# EAGLE design avr_bat (EAGLE 5.12)
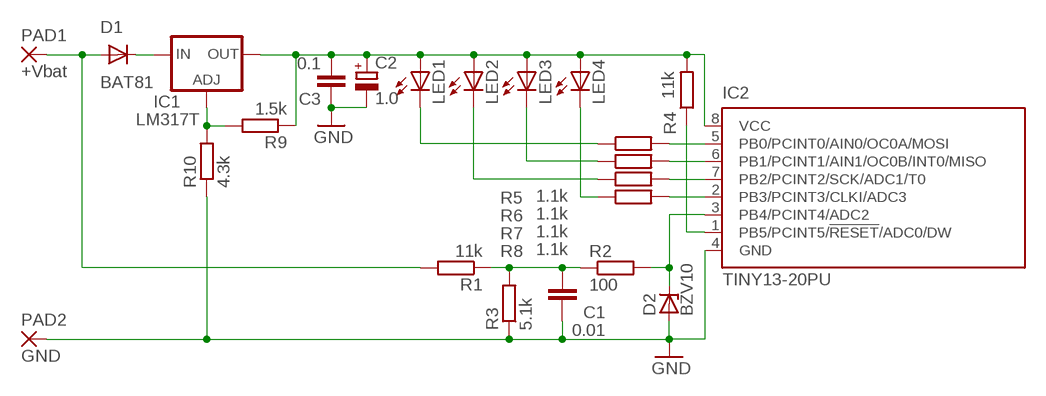
[diagram p0: schematic, sheet 1]

## Parts
C1  0.01  C-EU050-030X075  [C050-030X075]
C2  1.0  CPOL-EUE2-4  [E2-4]
C3  0.1  C-EU050-030X075  [C050-030X075]
D1  BAT81  [DO34-7]
D2  BZV10  [DO34Z7]
IC1  LM317T  LM317TL  [317TL]
IC2  TINY13-20PU  [DIL08]
LED1  LED5MM  [LED5MM]
LED2  LED5MM  [LED5MM]
LED3  LED5MM  [LED5MM]
LED4  LED5MM  [LED5MM]
PAD1  +Vbat  3,17/1,3  [3,17/1,3]
PAD2  GND  3,17/1,3  [3,17/1,3]
R1  11k  R-EU_0204/5  [0204/5]
R2  100  R-EU_0204/5  [0204/5]
R3  5.1k  R-EU_0204/5  [0204/5]
R4  11k  R-EU_0204/5  [0204/5]
R5  1.1k  R-EU_0204/5  [0204/5]
R6  1.1k  R-EU_0204/5  [0204/5]
R7  1.1k  R-EU_0204/5  [0204/5]
R8  1.1k  R-EU_0204/5  [0204/5]
R9  1.5k  R-EU_0204/5  [0204/5]
R10  4.3k  R-EU_0204/5  [0204/5]

## Nets
GND: C1.1 C2.- C3.1 D2.A IC2.4(GND) PAD2.1(P) R3.1 R10.1
N$1: IC2.1(PB5/PCINT5/!RESET!/ADC0/DW) R4.1
N$2: LED1.K(C) R5.1
N$3: IC2.5(PB0/PCINT0/AIN0/OC0A/MOSI) R5.2
N$4: LED2.K(C) R7.1
N$5: IC2.7(PB2/PCINT2/SCK/ADC1/T0) R7.2
N$6: IC2.6(PB1/PCINT1/AIN1/OC0B/INT0/MISO) R6.2
N$7: LED3.K(C) R6.1
N$8: LED4.K(C) R8.1
N$9: IC2.2(PB3/PCINT3/CLKI/ADC3) R8.2
N$10: D2.C IC2.3(PB4/PCINT4/ADC2) R2.2
N$11: C1.2 R1.1 R2.1 R3.2
N$12: IC1.1(ADJ) R9.2 R10.2
N$13: C2.+ C3.2 IC1.2(OUT) IC2.8(VCC) LED1.A LED2.A LED3.A LED4.A R4.2 R9.1
N$14: D1.C IC1.3(IN)
N$20: D1.A PAD1.1(P) R1.2

## Library data of the parts
C1 C3 = resistor:C-EU: CAPACITOR, European symbol
C2 = resistor:CPOL-EU: POLARIZED CAPACITOR, European symbol
D1 = diode:BAT81: DIODE barrier diode
D2 = diode:BZV10: Z DIODE
IC1 = v-reg:LM317TL: VOLTAGE REGULATOR
IC2 = atmel:TINY13: 8-bit AVR Microcontroller with 1K Bytes In-System Programmable Flash Source: http://www.atmel.com/dyn/resources/prod_documents/2535S.pdf; MPN: ATTINY13-20PU; OC_FARNELL: 9171550; OC_NEWARK: 96K6521
LED1-LED4 = led:LED: LED OSRAM: - CHIPLED LG R971, LG N971, LY N971, LG Q971, LY Q971, LO R971, LY R971 LH N974, LH R974 LS Q976, LO Q976, LY Q976 LO Q996 - Hyper CHIPLED LW Q18S LB Q993, LB Q99A, LB R99A - SideLED LS A670, LO A670, LY A670, LG A670, LP A670 LB A673, LV A673, LT A673, LW A673 LH A674 LY A675 LS A676, LA A676, LO A676, LY A676, LW A676 LS A679, LY A679, LG A679 - Hyper Micro SIDELED® LS Y876, LA Y876, LO Y876, LY Y876 LT Y87S - SmartLED LW L88C, LW L88S LB L89C, LB L89S, LG L890 LS L89K, LO L89K, LY L89K LS L896, LA L896, LO L896, LY L896 - TOPLED LS T670, LO T670, LY T670, LG T670, LP T670 LSG T670, LSP T670, LSY T670, LOP T670, LYG T670 LG T671, LOG T671, LSG T671 LB T673, LV T673, LT T673, LW T673 LH T674 LS T676, LA T676, LO T676, LY T676, LB T676, LH T676, LSB T676, LW T676 LB T67C, LV T67C, LT T67C, LS T67K, LO T67K, LY T67K, LW E67C LS E67B, LA E67B, LO E67B, LY E67B, LB E67C, LV E67C, LT E67C LW T67C LS T679, LY T679, LG T679 LS T770, LO T770, LY T770, LG T770, LP T770 LB T773, LV T773, LT T773, LW T773 LH T774 LS E675, LA E675, LY E675, LS T675 LS T776, LA T776, LO T776, LY T776, LB T776 LHGB T686 LT T68C, LB T68C - Hyper Mini TOPLED® LB M676 - Mini TOPLED Santana® LG M470 LS M47K, LO M47K, LY M47K Source: http://www.osram.convergy.de LUXEON: - LUMILED® LXK2-PW12-R00, LXK2-PW12-S00, LXK2-PW14-U00, LXK2-PW14-V00 LXK2-PM12-R00, LXK2-PM12-S00, LXK2-PM14-U00 LXK2-PE12-Q00, LXK2-PE12-R00, LXK2-PE12-S00, LXK2-PE14-T00, LXK2-PE14-U00 LXK2-PB12-K00, LXK2-PB12-L00, LXK2-PB12-M00, LXK2-PB14-N00, LXK2-PB14-P00, LXK2-PB14-Q00 LXK2-PR12-L00, LXK2-PR12-M00, LXK2-PR14-Q00, LXK2-PR14-R00 LXK2-PD12-Q00, LXK2-PD12-R00, LXK2-PD12-S00 LXK2-PH12-R00, LXK2-PH12-S00 LXK2-PL12-P00, LXK2-PL12-Q00, LXK2-PL12-R00 Source: www.luxeon.com KINGBRIGHT: KA-3528ASYC Source: www.kingbright.com
PAD1 PAD2 = wirepad:3,17/1,3: THROUGH-HOLE PAD
R1-R10 = resistor:R-EU_: RESISTOR, European symbol

## Board
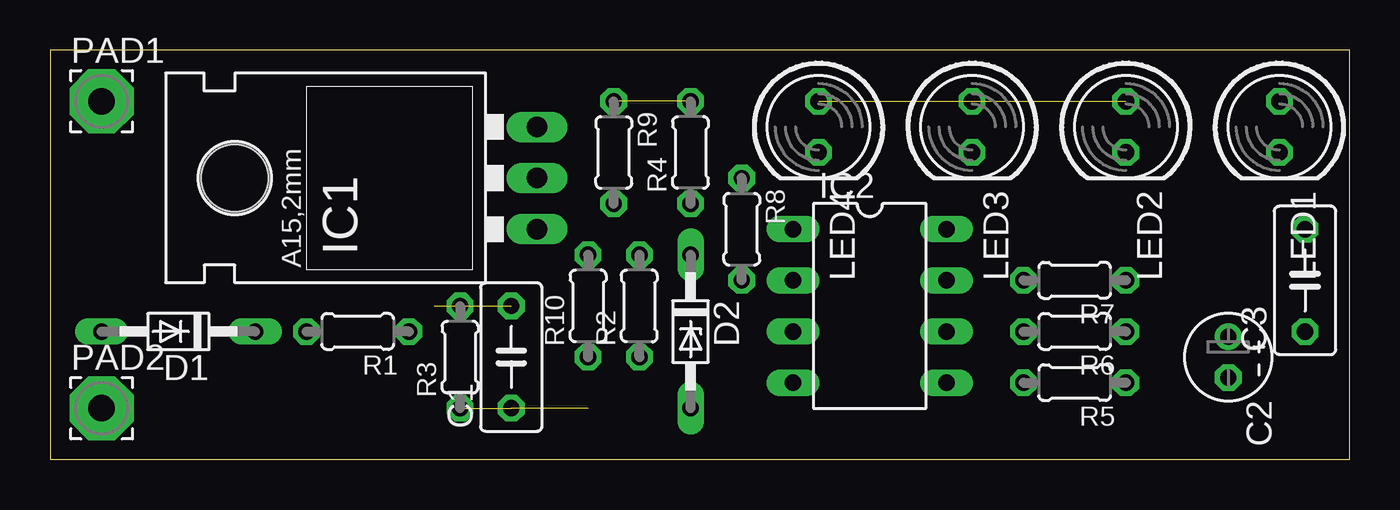
[diagram p1: board, top side]
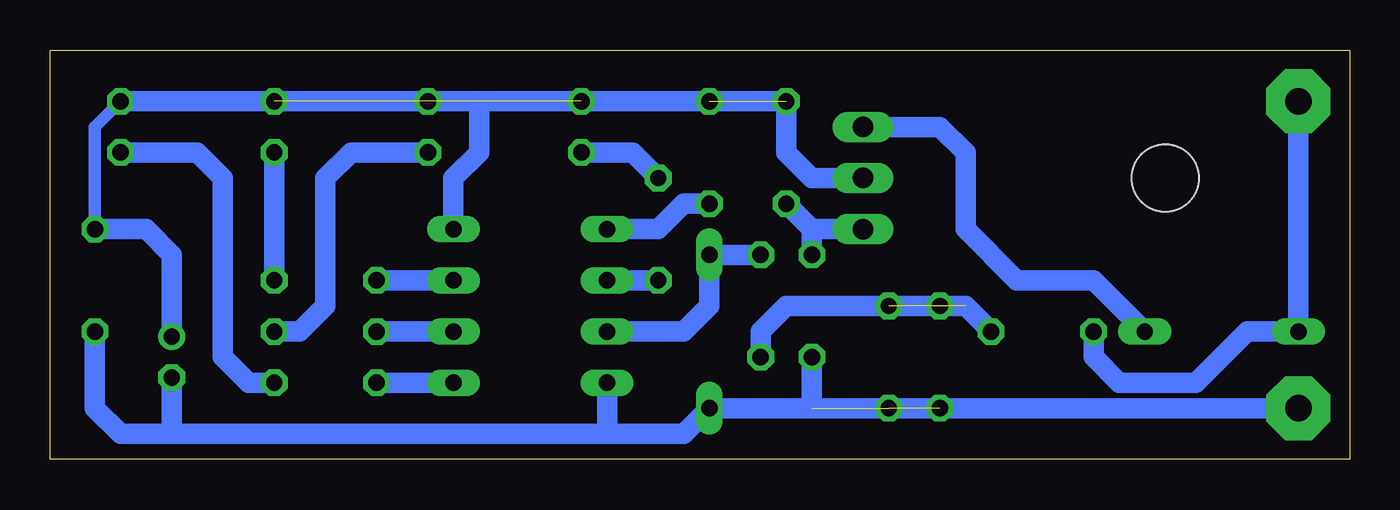
[diagram p2: board, bottom side, seen from below]

Size 64.44 x 20.31 mm. Coordinates in mm from the lower left corner, seen from the top.
Outline: 0,0 64.44,0 64.44,20.31 0,20.31 0,0
Copper layers (1*16): Top 0.035mm / dielectric 1.5mm / Bottom 0.035mm
Design rules "default": minimum track width 10mil, minimum drill 24mil, track to track 8mil, track to pad 8mil, pad to pad 8mil, via to via 8mil, smd to smd 8mil, copper to edge 40mil, drill to drill 8mil, minimum pad ring 10mil, minimum via ring 8mil, stop-mask expansion 4mil, vias tented up to drill 0mil, thermal gap 10mil

### Footprints (pad centres in the part's own frame; a part is rotated, then mirrored left to right if it is on the bottom)
C050-030X075 = drill 0.813 octagon: 1 -2.54,0; 2 2.54,0
E2-4 = drill 0.813 pad 1.27 round: + -1.016,0 | drill 0.813 pad 1.27 octagon: - 1.016,0
DO34-7 = drill 0.813 long: A 3.81,0; C -3.81,0
DO34Z7 = drill 0.813 long: A 3.81,0; C -3.81,0
317TL = drill 1.016 long: 1 -2.54,-3.81; 2 0,-3.81; 3 2.54,-3.81 | hole 3.302: 0,11.176
DIL08 = drill 0.813 long: 1 -3.81,-3.81; 2 -1.27,-3.81; 3 1.27,-3.81; 4 3.81,-3.81; 5 3.81,3.81; 6 1.27,3.81; 7 -1.27,3.81; 8 -3.81,3.81
LED5MM = drill 0.813 octagon: A -1.27,0; K 1.27,0
3,17/1,3 = drill 1.321 pad 3.175 octagon: 1 0,0
0204/5 = drill 0.813 octagon: 1 -2.54,0; 2 2.54,0

### Placement (x,y rotation side)
C1  22.86,5.08 90 top
C2  58.42,5.08 270 top
C3  62.23,8.89 90 top
D1  6.35,6.35 180 top
D2  31.75,6.35 270 top
IC1  20.32,13.97 90 top
IC2  40.64,7.62 270 top
LED1  60.96,16.51 270 top
LED2  53.34,16.51 270 top
LED3  45.72,16.51 270 top
LED4  38.1,16.51 270 top
PAD1  2.54,17.78 0 top
PAD2  2.54,2.54 0 top
R1  15.24,6.35 180 top
R2  29.21,7.62 90 top
R3  20.32,5.08 90 top
R4  31.75,15.24 90 top
R5  50.8,3.81 180 top
R6  50.8,6.35 180 top
R7  50.8,8.89 180 top
R8  34.29,11.43 270 top
R9  27.94,15.24 270 top
R10  26.67,7.62 90 top

### Tracks (layer width: path | path; a pad name or v marks a point on that pad's centre or on a via)
GND  (2 unrouted)
  Bottom 1.016: PAD2.1 26.67,2.54 | 26.67,2.54 D2.A 33.02,1.27 36.83,1.27 | 26.67,2.54 R10.1 | 36.83,1.27 58.42,1.27 | 58.42,1.27 C2.- | 36.83,1.27 IC2.4 | 58.42,1.27 60.96,1.27 62.23,2.54 C3.1
N$1
  Bottom 1.016: R4.1 33.02,12.7 34.29,11.43 IC2.1
N$2
  Bottom 1.016: R5.1 54.61,3.81 55.88,5.08 55.88,13.97 57.15,15.24 LED1.K
N$3
  Bottom 1.016: IC2.5 R5.2
N$4
  Bottom 1.016: R7.1 LED2.K
N$5
  Bottom 1.016: IC2.7 R7.2
N$6
  Bottom 1.016: IC2.6 R6.2
N$7
  Bottom 1.016: R6.1 52.07,6.35 50.8,7.62 50.8,13.97 49.53,15.24 LED3.K
N$8
  Bottom 1.016: R8.1 35.56,15.24 LED4.K
N$9
  Bottom 1.016: R8.2 IC2.2
N$10
  Bottom 1.016: IC2.3 33.02,6.35 31.75,7.62 D2.C R2.2
N$11  (2 unrouted)
  Bottom 1.016: R1.1 19.05,7.62 27.94,7.62 29.21,6.35 R2.1
N$12
  Bottom 1.016: IC1.1 26.67,11.43 | 26.67,11.43 R9.2 | R10.2 26.67,11.43
N$13  (4 unrouted)
  Bottom 0.61: LED1.A 62.23,16.51 C3.2
  Bottom 1.016: IC1.2 26.67,13.97 27.94,15.24 R9.1 43.18,17.78 | 43.18,17.78 LED1.A | IC2.8 44.45,13.97 43.18,15.24 43.18,17.78 | C2.+ 58.42,10.16 59.69,11.43 C3.2
N$14
  Bottom 1.016: D1.C 12.7,8.89 16.51,8.89 19.05,11.43 19.05,15.24 20.32,16.51 IC1.3
N$20
  Bottom 1.016: PAD1.1 D1.A 5.08,6.35 7.62,3.81 11.43,3.81 12.7,5.08 R1.2